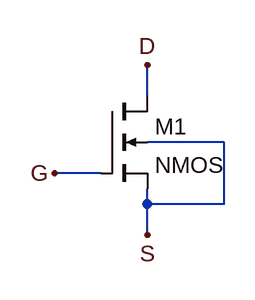
[diagram p0: schematic nmos.asc]
nmos.asc, the LTspice schematic file:
Version 4
SHEET 1 880 680
WIRE -80 -96 -80 -128
WIRE 0 -48 -80 -48
WIRE -128 -16 -176 -16
WIRE -80 16 -80 0
WIRE 0 16 0 -48
WIRE 0 16 -80 16
WIRE -80 48 -80 16
FLAG -176 -16 G
FLAG -80 48 S
FLAG -80 -128 D
SYMBOL nmos4 -128 -96 R0
SYMATTR InstName M1

The netlist it stands for:
* nmos.asc
M1 D G S S NMOS
.model NMOS NMOS
.model PMOS PMOS
.lib standard.mos
.backanno
.end